# EAGLE design untitled (EAGLE 9.6.2)
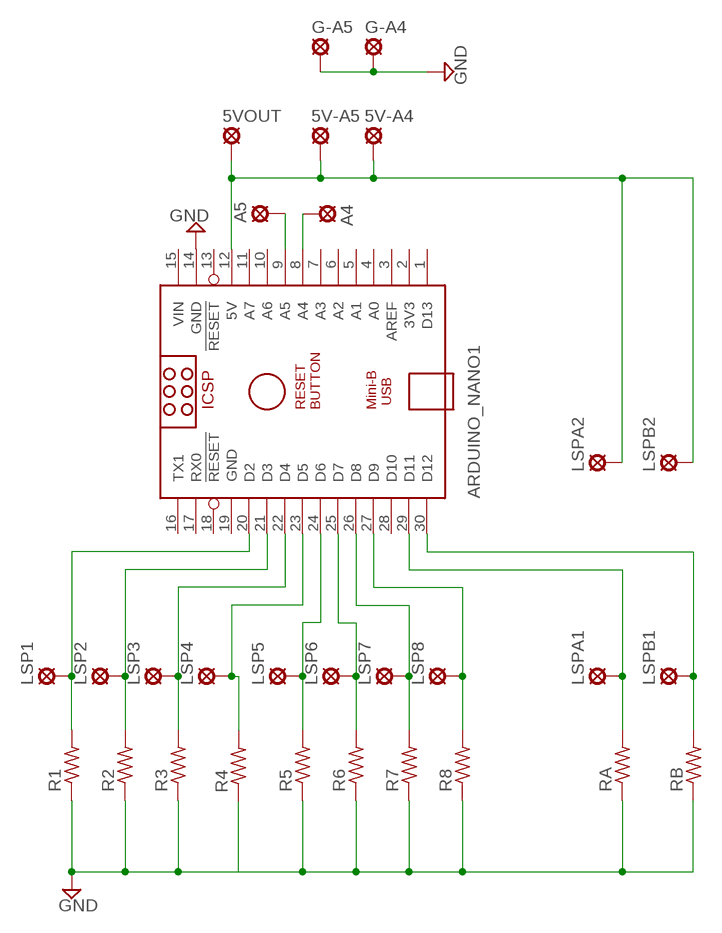
[diagram p0: schematic, sheet 1]

## Parts
5V-A4  LSP10  [LSP10]
5V-A5  LSP10  [LSP10]
5VOUT  LSP10  [LSP10]
A4  LSP10  [LSP10]
A5  LSP10  [LSP10]
ARDUINO_NANO1  ARDUINO_NANO  [ARDUINO_NANO]
G-A4  LSP10  [LSP10]
G-A5  LSP10  [LSP10]
LSP1  LSP10  [LSP10]
LSP2  LSP10  [LSP10]
LSP3  LSP10  [LSP10]
LSP4  LSP10  [LSP10]
LSP5  LSP10  [LSP10]
LSP6  LSP10  [LSP10]
LSP7  LSP10  [LSP10]
LSP8  LSP10  [LSP10]
LSPA1  LSP10  [LSP10]
LSPA2  LSP10  [LSP10]
LSPB1  LSP10  [LSP10]
LSPB2  LSP10  [LSP10]
R1  R-US_0309/12  [0309/12]
R2  R-US_0309/12  [0309/12]
R3  R-US_0309/12  [0309/12]
R4  R-US_0309/12  [0309/12]
R5  R-US_0309/12  [0309/12]
R6  R-US_0309/12  [0309/12]
R7  R-US_0309/12  [0309/12]
R8  R-US_0309/12  [0309/12]
RA  R-US_0309/12  [0309/12]
RB  R-US_0309/12  [0309/12]

## Nets
GND: ARDUINO_NANO1.14(GND) G-A4.MP G-A5.MP R1.1 R2.1 R3.1 R4.1 R5.1 R6.1 R7.1 R8.1 RA.1 RB.1
N$1: 5V-A4.MP 5V-A5.MP 5VOUT.MP ARDUINO_NANO1.12(5V) LSPA2.MP LSPB2.MP
N$2: ARDUINO_NANO1.20(D2) LSP1.MP R1.2
N$3: A5.MP ARDUINO_NANO1.9(A5)
N$4: ARDUINO_NANO1.21(D3) LSP2.MP R2.2
N$5: ARDUINO_NANO1.22(D4) LSP3.MP R3.2
N$6: ARDUINO_NANO1.23(D5) LSP4.MP R4.2
N$7: ARDUINO_NANO1.24(D6) LSP5.MP R5.2
N$8: ARDUINO_NANO1.25(D7) LSP6.MP R6.2
N$9: ARDUINO_NANO1.26(D8) LSP7.MP R7.2
N$10: ARDUINO_NANO1.27(D9) LSP8.MP R8.2
N$11: ARDUINO_NANO1.30(D12) LSPB1.MP RB.2
N$12: ARDUINO_NANO1.29(D11) LSPA1.MP RA.2
N$13: A4.MP ARDUINO_NANO1.8(A4)
Unconnected: ARDUINO_NANO1.1(D13) ARDUINO_NANO1.2(3V3) ARDUINO_NANO1.3(AREF) ARDUINO_NANO1.4(A0) ARDUINO_NANO1.5(A1) ARDUINO_NANO1.6(A2) ARDUINO_NANO1.7(A3) ARDUINO_NANO1.10(A6) ARDUINO_NANO1.11(A7) ARDUINO_NANO1.13(!RESET) ARDUINO_NANO1.16(TX1) ARDUINO_NANO1.17(RX0) ARDUINO_NANO1.18(!RESET) ARDUINO_NANO1.28(D10)

## Power pins joined to a net without a drawn wire
GND: ARDUINO_NANO1.19(GND)
VIN: ARDUINO_NANO1.15(VIN)

## Library data of the parts
5V-A4 5V-A5 5VOUT A4 A5 G-A4 G-A5 LSP1-LSP8 LSPA1 LSPA2 LSPB1 LSPB2 = solpad:LSP10: SOLDER PAD drill 1.0 mm, distributor Buerklin, 12H555
ARDUINO_NANO1 = ArduinoNanoV30:ARDUINO_NANO: Arduino Nano V3.0 Overview: The Arduino Nano is a small, complete, and breadboard-friendly board based on the ATmega328 (Arduino Nano 3.x) or ATmega168 (Arduino Nano 2.x). It has more or less the same functionality of the Arduino Duemilanove, but in a different package. It lacks only a DC power jack, and works with a Mini-B USB cable instead of a standard one. The Nano was designed and is being produced by Gravitech. Specifications: Microcontroller Atmel ATmega168 or ATmega328 Operating Voltage (logic level) 5 V Input Voltage (recommended) 7-12 V Input Voltage (limits) 6-20 V Digital I/O Pins 14 (of which 6 provide PWM output) Analog Input Pins 8 DC Current per I/O Pin 40 mA Flash Memory 16 KB (ATmega168) or 32 KB (ATmega328) of which 2 KB used by bootloader SRAM 1 KB (ATmega168) or 2 KB (ATmega328) EEPROM 512 bytes (ATmega168) or 1 KB (ATmega328) Clock Speed 16 MHz Dimensions 0.73" x 1.70" Length 45 mm Width 18 mm Weigth 5 g Power: The Arduino Nano can be powered via the Mini-B USB connection, 6-20V unregulated external power supply (pin 30), or 5V regulated external power supply (pin 27). The power source is automatically selected to the highest voltage source. Memory: The ATmega168 has 16 KB of flash memory for storing code (of which 2 KB is used for the bootloader); the ATmega328 has 32 KB, (also with 2 KB used for the bootloader). The ATmega168 has 1 KB of SRAM and 512 bytes of EEPROM (which can be read and written with the EEPROM library); the ATmega328 has 2 KB of SRAM and 1 KB of EEPROM. Input and Output: Each of the 14 digital pins on the Nano can be used as an input or output, using pinMode(), digitalWrite(), and digitalRead() functions. They operate at 5 volts. Each pin can provide or receive a maximum of 40 mA and has an internal pull-up resistor (disconnected by default) of 20-50 kOhms. In addition, some pins have specialized functions. Visit Arduino - ArduinoBoardNano <https://www.arduino.cc/en/Main/ArduinoBoardNano>
R1-R8 RA RB = rcl:R-US_: RESISTOR, American symbol; SPICEPREFIX: R

## Board
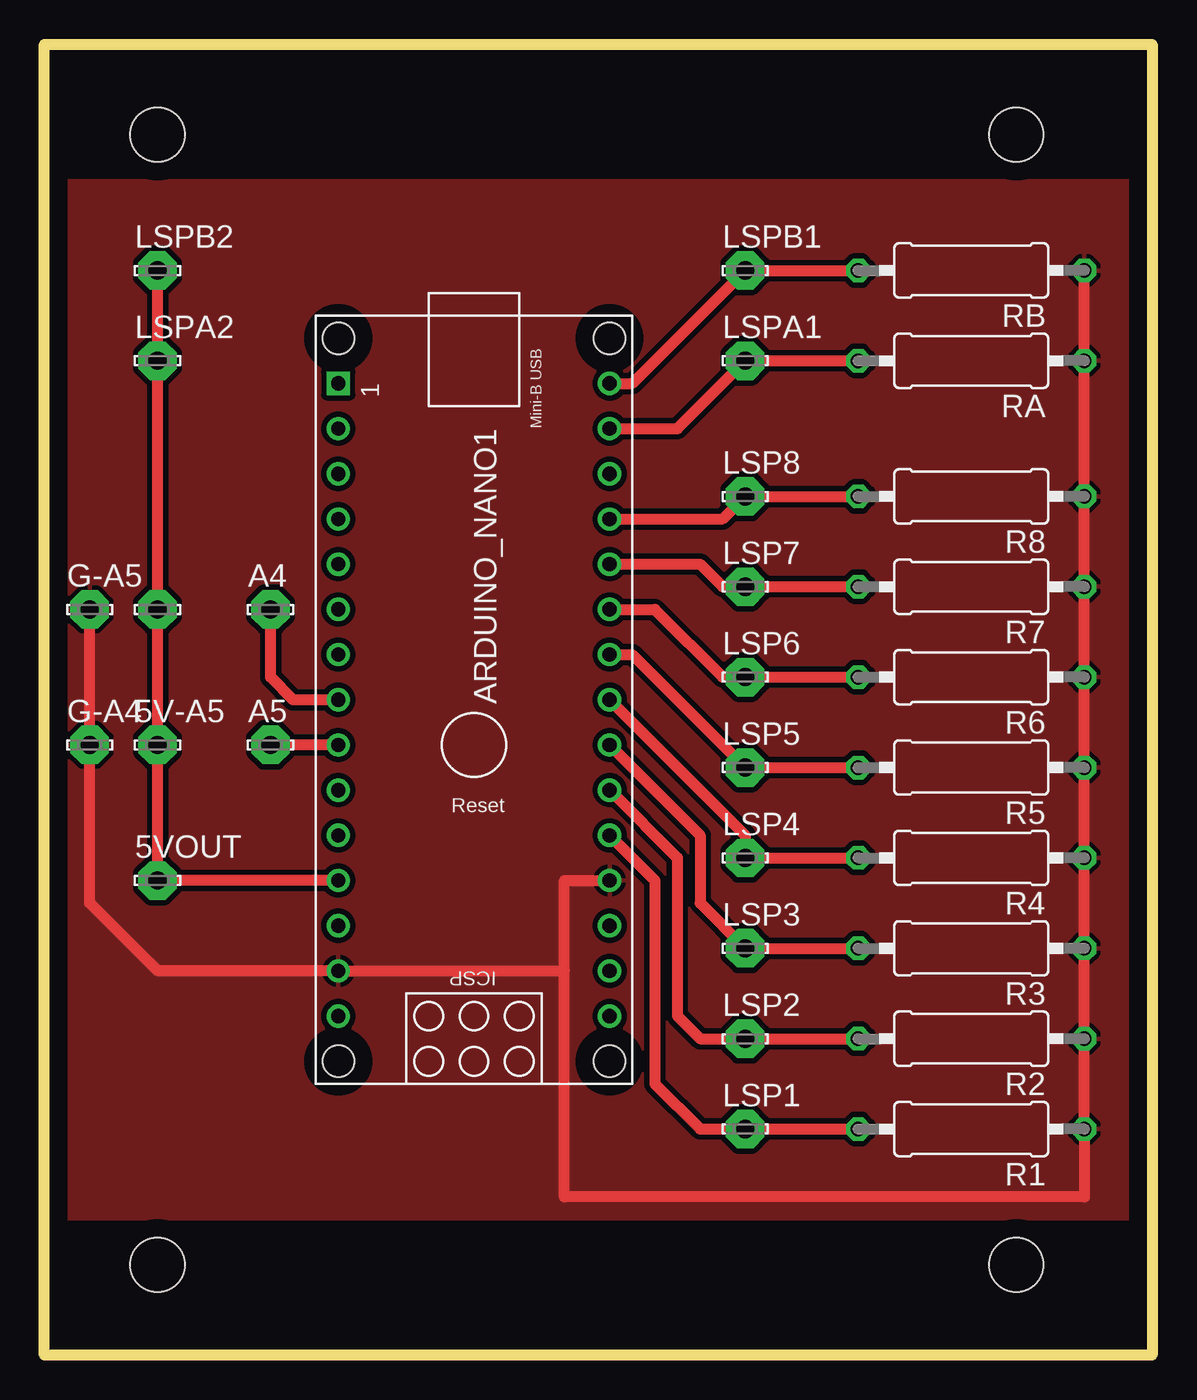
[diagram p1: board, top side]

Size 62.23 x 73.66 mm. Coordinates in mm from the lower left corner, seen from the top.
Outline: 0,73.66 62.23,73.66 62.23,0 0,0 0,73.66
Copper layers (1*16): Top 0.035mm / dielectric 1.5mm / Bottom 0.035mm
Design rules "default *": minimum track width 24mil, minimum drill 0.35mm, track to track 12mil, track to pad 12mil, pad to pad 12mil, via to via 12mil, smd to smd 12mil, copper to edge 40mil, drill to drill 6mil, minimum pad ring 10mil, minimum via ring 8mil, stop-mask expansion 4mil, vias tented up to drill 8mil, thermal gap 10mil
Holes 3.05 mm at 6.35,5.08 54.61,5.08 6.35,68.58 54.61,68.58

### Footprints (pad centres in the part's own frame; a part is rotated, then mirrored left to right if it is on the bottom)
LSP10 = drill 1.016 pad 2.159 octagon: MP 0,0
ARDUINO_NANO = drill 0.8 square: 1 -20.32,-7.62 | drill 0.8: 2 -17.78,-7.62; 3 -15.24,-7.62; 4 -12.7,-7.62; 5 -10.16,-7.62; 6 -7.62,-7.62; 7 -5.08,-7.62; 8 -2.54,-7.62; 9 0,-7.62; 10 2.54,-7.62; 11 5.08,-7.62; 12 7.62,-7.62; 13 10.16,-7.62; 14 12.7,-7.62; 15 15.24,-7.62; 16 15.24,7.62; 17 12.7,7.62; 18 10.16,7.62; 19 7.62,7.62; 20 5.08,7.62; 21 2.54,7.62; 22 0,7.62; 23 -2.54,7.62; 24 -5.08,7.62; 25 -7.62,7.62; 26 -10.16,7.62; 27 -12.7,7.62; 28 -15.24,7.62; 29 -17.78,7.62; 30 -20.32,7.62 | hole 1.778: -22.86,-7.62; -22.86,7.62; 17.78,7.62; 17.78,-7.62
0309/12 = drill 0.813 octagon: 1 -6.35,0; 2 6.35,0

### Placement (x,y rotation side)
5V-A4  6.35,41.91 0 top
5V-A5  6.35,34.29 0 top
5VOUT  6.35,26.67 0 top
A4  12.7,41.91 0 top
A5  12.7,34.29 0 top
ARDUINO_NANO1  24.13,34.29 270 top
G-A4  2.54,34.29 0 top
G-A5  2.54,41.91 0 top
LSP1  39.37,12.7 0 top
LSP2  39.37,17.78 0 top
LSP3  39.37,22.86 0 top
LSP4  39.37,27.94 0 top
LSP5  39.37,33.02 0 top
LSP6  39.37,38.1 0 top
LSP7  39.37,43.18 0 top
LSP8  39.37,48.26 0 top
LSPA1  39.37,55.88 0 top
LSPA2  6.35,55.88 0 top
LSPB1  39.37,60.96 0 top
LSPB2  6.35,60.96 0 top
R1  52.07,12.7 180 top
R2  52.07,17.78 180 top
R3  52.07,22.86 180 top
R4  52.07,27.94 180 top
R5  52.07,33.02 180 top
R6  52.07,38.1 180 top
R7  52.07,43.18 180 top
R8  52.07,48.26 180 top
RA  52.07,55.88 180 top
RB  52.07,60.96 180 top

### Tracks (layer width: path | path; a pad name or v marks a point on that pad's centre or on a via)
GND
  Top 0.61: RB.1 R3.1 R2.1 R1.1 58.42,8.89 29.21,8.89 29.21,21.59 | 29.21,21.59 29.21,26.67 ARDUINO_NANO1.19 | 29.21,21.59 ARDUINO_NANO1.14 6.35,21.59 2.54,25.4 G-A4.MP G-A5.MP
  pour Top (isolate 0.032): 0,66.04 0,7.62 60.96,7.62 60.96,66.04
N$1
  Top 0.61: ARDUINO_NANO1.12 5VOUT.MP 5V-A5.MP 5V-A4.MP LSPA2.MP LSPB2.MP
N$2
  Top 0.61: ARDUINO_NANO1.20 34.29,26.67 34.29,15.24 36.83,12.7 LSP1.MP R1.2
N$3
  Top 0.61: ARDUINO_NANO1.9 A5.MP
N$4
  Top 0.61: ARDUINO_NANO1.21 35.56,27.94 35.56,19.05 36.83,17.78 LSP2.MP R2.2
N$5
  Top 0.61: ARDUINO_NANO1.22 36.83,29.21 36.83,25.4 LSP3.MP R3.2
N$6
  Top 0.61: ARDUINO_NANO1.23 39.37,29.21 LSP4.MP R4.2
N$7
  Top 0.61: ARDUINO_NANO1.24 33.02,39.37 LSP5.MP R5.2
N$8
  Top 0.61: ARDUINO_NANO1.25 34.29,41.91 38.1,38.1 LSP6.MP R6.2
N$9
  Top 0.61: ARDUINO_NANO1.26 36.83,44.45 38.1,43.18 LSP7.MP R7.2
N$10
  Top 0.61: ARDUINO_NANO1.27 38.1,46.99 LSP8.MP R8.2
N$11
  Top 0.61: ARDUINO_NANO1.30 33.02,54.61 LSPB1.MP RB.2
N$12
  Top 0.61: ARDUINO_NANO1.29 35.56,52.07 LSPA1.MP RA.2
N$13
  Top 0.61: ARDUINO_NANO1.8 13.97,36.83 12.7,38.1 A4.MP